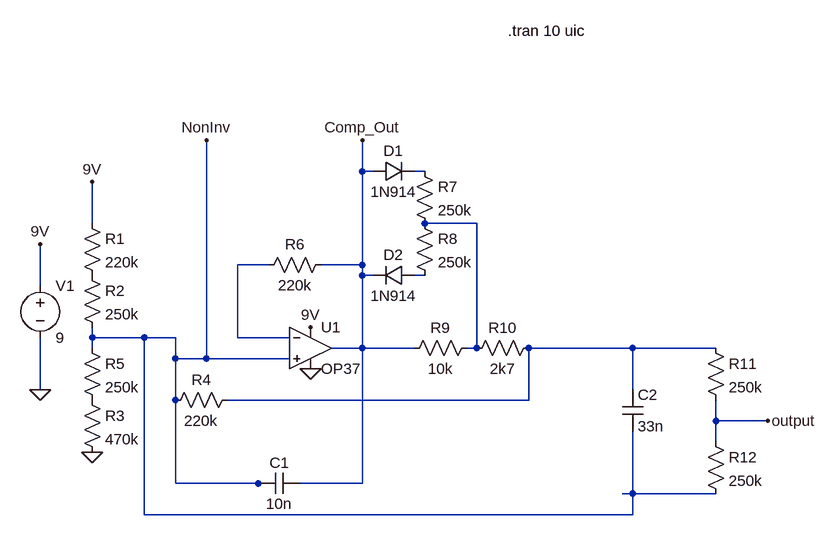
[diagram p0: schematic Draft1.asc]
Draft1.asc, the LTspice schematic file:
Version 4
SHEET 1 1728 680
WIRE 640 144 640 96
WIRE 656 144 640 144
WIRE 736 144 720 144
WIRE 224 224 224 160
WIRE 816 224 736 224
WIRE 496 288 448 288
WIRE 640 288 640 144
WIRE 640 288 576 288
WIRE 640 304 640 288
WIRE 656 304 640 304
WIRE 736 304 720 304
WIRE 144 320 144 256
WIRE 224 400 224 384
WIRE 304 400 224 400
WIRE 352 400 304 400
WIRE 448 400 448 288
WIRE 528 400 448 400
WIRE 224 416 224 400
WIRE 640 416 640 304
WIRE 640 416 592 416
WIRE 720 416 640 416
WIRE 816 416 816 224
WIRE 816 416 800 416
WIRE 1056 416 896 416
WIRE 1184 416 1056 416
WIRE 352 432 352 400
WIRE 400 432 400 96
WIRE 400 432 352 432
WIRE 528 432 400 432
WIRE 144 480 144 400
WIRE 1056 480 1056 416
WIRE 352 496 352 432
WIRE 896 496 896 416
WIRE 896 496 432 496
WIRE 1184 528 1184 496
WIRE 1264 528 1184 528
WIRE 1184 560 1184 528
WIRE 352 624 352 496
WIRE 480 624 352 624
WIRE 496 624 480 624
WIRE 640 624 640 416
WIRE 640 624 544 624
WIRE 1056 640 1056 544
WIRE 1056 640 1040 640
WIRE 1184 640 1056 640
WIRE 304 672 304 400
WIRE 1056 672 1056 640
WIRE 1056 672 304 672
FLAG 144 480 0
FLAG 224 160 9V
FLAG 144 256 9V
FLAG 400 96 NonInv
FLAG 640 96 Comp_Out
FLAG 224 576 0
FLAG 1264 528 output
FLAG 560 448 0
FLAG 560 384 9V
SYMBOL res 208 208 R0
SYMATTR InstName R1
SYMATTR Value 220k
SYMBOL res 448 480 R90
WINDOW 0 0 56 VBottom 2
WINDOW 3 32 56 VTop 2
SYMATTR InstName R4
SYMATTR Value 220k
SYMBOL voltage 144 304 R0
SYMATTR InstName V1
SYMATTR Value 9
SYMBOL res 208 480 R0
SYMATTR InstName R3
SYMATTR Value 470k
SYMBOL res 208 288 R0
SYMATTR InstName R2
SYMATTR Value 250k
SYMBOL res 208 400 R0
SYMATTR InstName R5
SYMATTR Value 250k
SYMBOL res 592 272 R90
WINDOW 0 0 56 VBottom 2
WINDOW 3 32 56 VTop 2
SYMATTR InstName R6
SYMATTR Value 220k
SYMBOL res 720 128 R0
SYMATTR InstName R7
SYMATTR Value 250k
SYMBOL res 720 208 R0
SYMATTR InstName R8
SYMATTR Value 250k
SYMBOL diode 656 160 R270
WINDOW 0 32 32 VTop 2
WINDOW 3 0 32 VBottom 2
SYMATTR InstName D1
SYMATTR Value 1N914
SYMBOL diode 720 288 R90
WINDOW 0 0 32 VBottom 2
WINDOW 3 32 32 VTop 2
SYMATTR InstName D2
SYMATTR Value 1N914
SYMBOL res 816 400 R90
WINDOW 0 0 56 VBottom 2
WINDOW 3 32 56 VTop 2
SYMATTR InstName R9
SYMATTR Value 10k
SYMBOL res 912 400 R90
WINDOW 0 0 56 VBottom 2
WINDOW 3 32 56 VTop 2
SYMATTR InstName R10
SYMATTR Value 2k7
SYMBOL cap 544 608 R90
WINDOW 0 0 32 VBottom 2
WINDOW 3 32 32 VTop 2
SYMATTR InstName C1
SYMATTR Value 10n
SYMBOL cap 1040 480 R0
SYMATTR InstName C2
SYMATTR Value 33n
SYMBOL res 1168 400 R0
SYMATTR InstName R11
SYMATTR Value 250k
SYMBOL res 1168 544 R0
SYMATTR InstName R12
SYMATTR Value 250k
SYMBOL Opamps/OP37 560 352 R0
SYMATTR InstName U1
TEXT 864 -72 Left 2 !.tran 10 uic

The netlist it stands for:
* Draft1.asc
R1 9V P001 220k
R4 N005 NonInv 220k
V1 9V 0 9
R3 P002 0 470k
R2 P001 NonInv 250k
R5 NonInv P002 250k
R6 Comp_Out N003 220k
R7 N001 N002 250k
R8 N002 N004 250k
D1 Comp_Out N001 1N914
D2 N004 Comp_Out 1N914
R9 N002 Comp_Out 10k
R10 N005 N002 2k7
C1 Comp_Out NonInv 10n
C2 N005 NonInv 33n
R11 N005 output 250k
R12 output NonInv 250k
XU1 NonInv N003 9V 0 Comp_Out LT1037  ; OP37, pins In+ In- V+ V- OUT
.model D D
.lib standard.dio
.tran 10 uic
.lib LTC.lib
.backanno
.end